# Altium schematic sheet 3 - Drivers.SchDoc
size A4
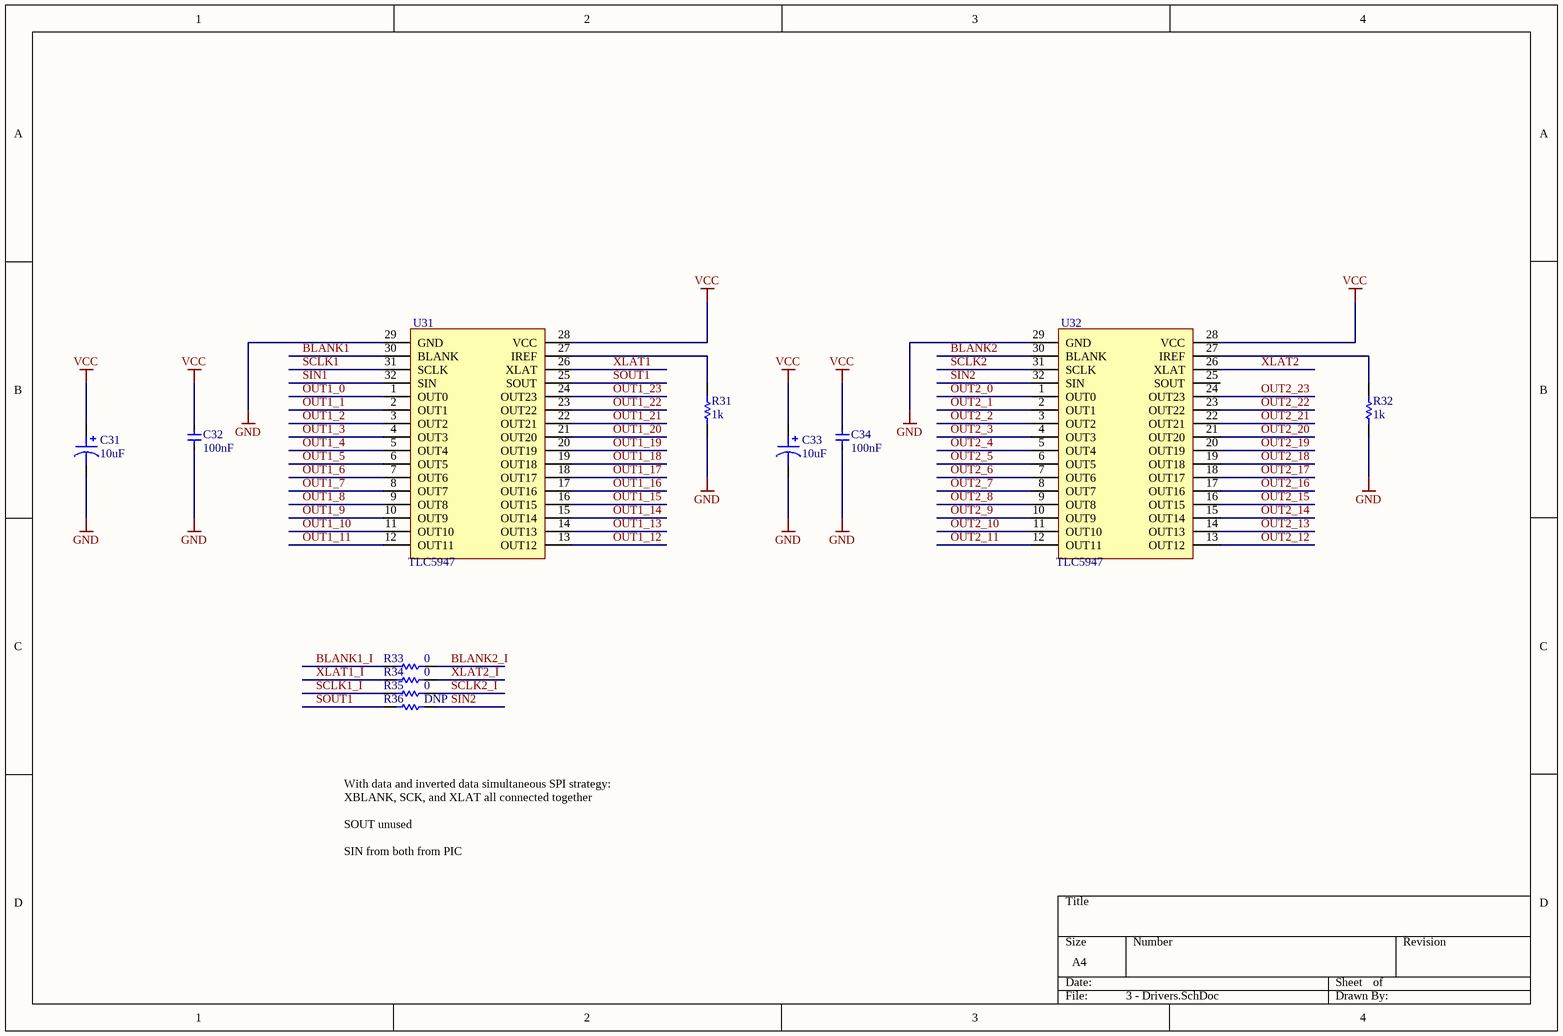
[diagram p0: 3 - Drivers.SchDoc]

## Parts
C31  10uF  [CAP_ELEC_5x5.7]
C32  value 100nF  [CAP 0603/1608]  (hidden comment: Cap_0603)
C33  10uF  [CAP_ELEC_5x5.7]
C34  value 100nF  [CAP 0603/1608]  (hidden comment: Cap_0603)
R31  value 1k  [RES_0603]  (hidden comment: Res1)
R32  value 1k  [RES_0603]  (hidden comment: Res1)
R33  value 0  [RES_0603]  (hidden comment: Res1)
R34  value 0  [RES_0603]  (hidden comment: Res1)
R35  value 0  [RES_0603]  (hidden comment: Res1)
R36  value DNP  [RES_0603]  (hidden comment: Res1)
U31  TLC5947  [QFN50P500X500X100-33N]
U32  TLC5947  [QFN50P500X500X100-33N]

## Nets
GND: C31.2 C32.1 C33.2 C34.1 R31.1 R32.1 U31.29(GND) U32.29(GND)
VCC: C31.1 C32.2 C33.1 C34.2 U31.28(VCC) U32.28(VCC)
BLANK1: U31.30(BLANK)
BLANK1_I: R33.2
BLANK2: U32.30(BLANK)
BLANK2_I: R33.1
OUT1_0: U31.1(OUT0)
OUT1_1: U31.2(OUT1)
OUT1_2: U31.3(OUT2)
OUT1_3: U31.4(OUT3)
OUT1_4: U31.5(OUT4)
OUT1_5: U31.6(OUT5)
OUT1_6: U31.7(OUT6)
OUT1_7: U31.8(OUT7)
OUT1_8: U31.9(OUT8)
OUT1_9: U31.10(OUT9)
OUT1_10: U31.11(OUT10)
OUT1_11: U31.12(OUT11)
OUT1_12: U31.13(OUT12)
OUT1_13: U31.14(OUT13)
OUT1_14: U31.15(OUT14)
OUT1_15: U31.16(OUT15)
OUT1_16: U31.17(OUT16)
OUT1_17: U31.18(OUT17)
OUT1_18: U31.19(OUT18)
OUT1_19: U31.20(OUT19)
OUT1_20: U31.21(OUT20)
OUT1_21: U31.22(OUT21)
OUT1_22: U31.23(OUT22)
OUT1_23: U31.24(OUT23)
OUT2_0: U32.1(OUT0)
OUT2_1: U32.2(OUT1)
OUT2_2: U32.3(OUT2)
OUT2_3: U32.4(OUT3)
OUT2_4: U32.5(OUT4)
OUT2_5: U32.6(OUT5)
OUT2_6: U32.7(OUT6)
OUT2_7: U32.8(OUT7)
OUT2_8: U32.9(OUT8)
OUT2_9: U32.10(OUT9)
OUT2_10: U32.11(OUT10)
OUT2_11: U32.12(OUT11)
OUT2_12: U32.13(OUT12)
OUT2_13: U32.14(OUT13)
OUT2_14: U32.15(OUT14)
OUT2_15: U32.16(OUT15)
OUT2_16: U32.17(OUT16)
OUT2_17: U32.18(OUT17)
OUT2_18: U32.19(OUT18)
OUT2_19: U32.20(OUT19)
OUT2_20: U32.21(OUT20)
OUT2_21: U32.22(OUT21)
OUT2_22: U32.23(OUT22)
OUT2_23: U32.24(OUT23)
SCLK1: U31.31(SCLK)
SCLK1_I: R35.2
SCLK2: U32.31(SCLK)
SCLK2_I: R35.1
SIN1: U31.32(SIN)
SIN2: R36.1 U32.32(SIN)
SOUT1: R36.2 U31.25(SOUT)
XLAT1: U31.26(XLAT)
XLAT1_I: R34.2
XLAT2: U32.26(XLAT)
XLAT2_I: R34.1
NetR31_2: R31.2 U31.27(IREF)
NetR32_2: R32.2 U32.27(IREF)

Not connected (* = marked no-connect by the designer): U31 33(GND); U32 25(SOUT) 33(GND)

## Notes on the sheet
- With data and inverted data simultaneous SPI strategy:
  XBLANK, SCK, and XLAT all connected together
  SOUT unused
  SIN from both from PIC

## Library data of the parts
C31 C33 = Polarised Capacitor: SMT Polarised Capacitor; Value: 10uF
C32 C34 = Cap_0603: Capacitor
R31-R36 = Res1: Resistor; Published: 8-Jun-2000; LatestRevisionDate: 17-Jul-2002; LatestRevisionNote: Re-released for DXP Platform.; PackageReference: AXIAL-0.3; Publisher: Altium Limited; PackageDescription: Axial Device, Thru-Hole; 2 Leads; 0.3 in Pin Spacing
U31 U32 = TLC5947: LED Driver